# Altium project Tone_Stack_V2.PrjPcb
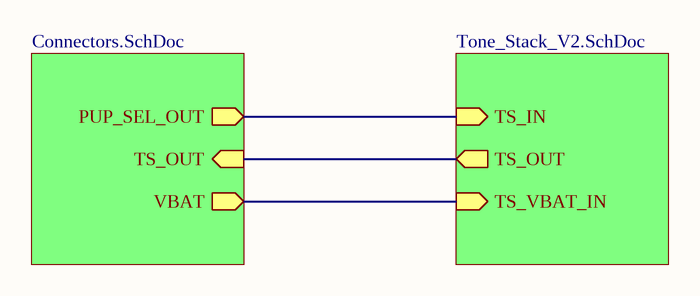
[diagram p0: Top.SchDoc]
3 sheets, 28 parts. Net scope: hierarchical (ports join the sheet entries above them; power ports are global).
Board file: Tone_Stack_V2.PcbDoc
Sheets:
  Top.SchDoc
    Designator = Connectors.SchDoc
    Designator = Tone_Stack_V2.SchDoc

## Sheet Top.SchDoc
size A4

### Sub-sheets
Designator = Connectors.SchDoc: PUP_SEL_OUT (out), TS_OUT (in), VBAT (out)
Designator = Tone_Stack_V2.SchDoc: TS_IN (in), TS_OUT (out), TS_VBAT_IN (in)

### Nets
PUP_SEL_OUT: sheet Designator/PUP_SEL_OUT, sheet Designator/TS_IN
TS_OUT: sheet Designator/TS_OUT, sheet Designator/TS_OUT
VBAT: sheet Designator/VBAT, sheet Designator/TS_VBAT_IN

## Sheet Connectors.SchDoc
size A4
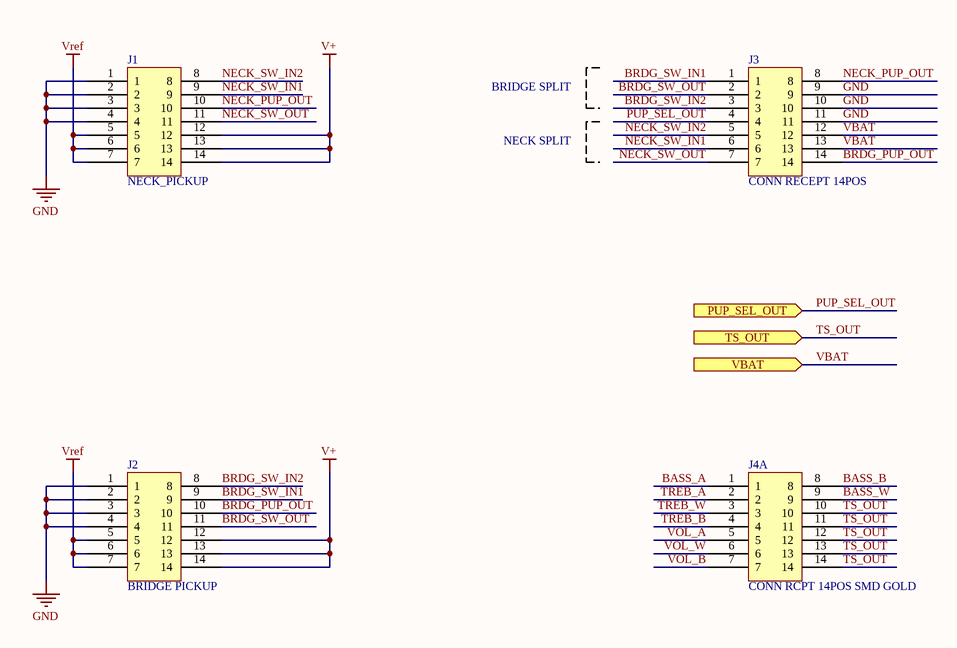
[diagram p1: Connectors.SchDoc]

### Parts
J1  CONN HEADER 14POS  [DF12(3.0)-14DP]  (value not drawn)
J2  CONN HEADER 14POS  [DF12(3.0)-14DP]  (value not drawn)
J3  CONN RECEPT 14POS  [DF12(3.0)-14DS]
J4  CONN RCPT 14POS SMD GOLD  [DF12(3.0)-14DS]  (part A of 4)

### Ports
PUP_SEL_OUT (in), TS_OUT (in), VBAT (in)

### Nets
GND: J1.1 J1.2 J1.3 J1.4 J2.1 J2.2 J2.3 J2.4 J3.9 J3.10 J3.11
V+: J1.12 J1.13 J1.14 J2.12 J2.13 J2.14
Vref: J1.5 J1.6 J1.7 J2.5 J2.6 J2.7
BASS_A: J4.1
BASS_B: J4.8
BASS_W: J4.9
BRDG_PUP_OUT: J2.10 J3.14
BRDG_SW_IN1: J2.9 J3.1
BRDG_SW_IN2: J2.8 J3.3
BRDG_SW_OUT: J2.11 J3.2
NECK_PUP_OUT: J1.10 J3.8
NECK_SW_IN1: J1.9 J3.6
NECK_SW_IN2: J1.8 J3.5
NECK_SW_OUT: J1.11 J3.7
PUP_SEL_OUT: J3.4 ; port PUP_SEL_OUT
TREB_A: J4.2
TREB_B: J4.4
TREB_W: J4.3
TS_OUT: J4.10 J4.11 J4.12 J4.13 J4.14 ; port TS_OUT
VBAT: J3.12 J3.13 ; port VBAT
VOL_A: J4.5
VOL_B: J4.7
VOL_W: J4.6

### Notes on the sheet
- BRIDGE SPLIT
- NECK SPLIT
- (near J1) NECK_PICKUP
- (near J2) BRIDGE PICKUP

### Library data of the parts
J1 J2 = DF12(3.0)-14DP-0.5V(86): 14 Position Connector Header, Outer Shroud Contacts Surface Mount Gold; Manufacturer: Hirose; Digikey Part Number: H11701CT-ND
J3 = DF12(3.0)-14DS-0.5V(86): 14 Position Connector Receptacle, Center Strip Contacts Surface Mount Gold; Manufacturer: Hirose; Digikey Part Number: H11702CT-ND
J4 = DF12(3.0)-14DS-0.5V(86)-COMPOSITE: 14 Position Connector Header, Outer Shroud Contacts Surface Mount Gold; Manufacturer: Hirose; Digikey Part Number: H11702CT-ND

## Sheet Tone_Stack_V2.SchDoc
size A4
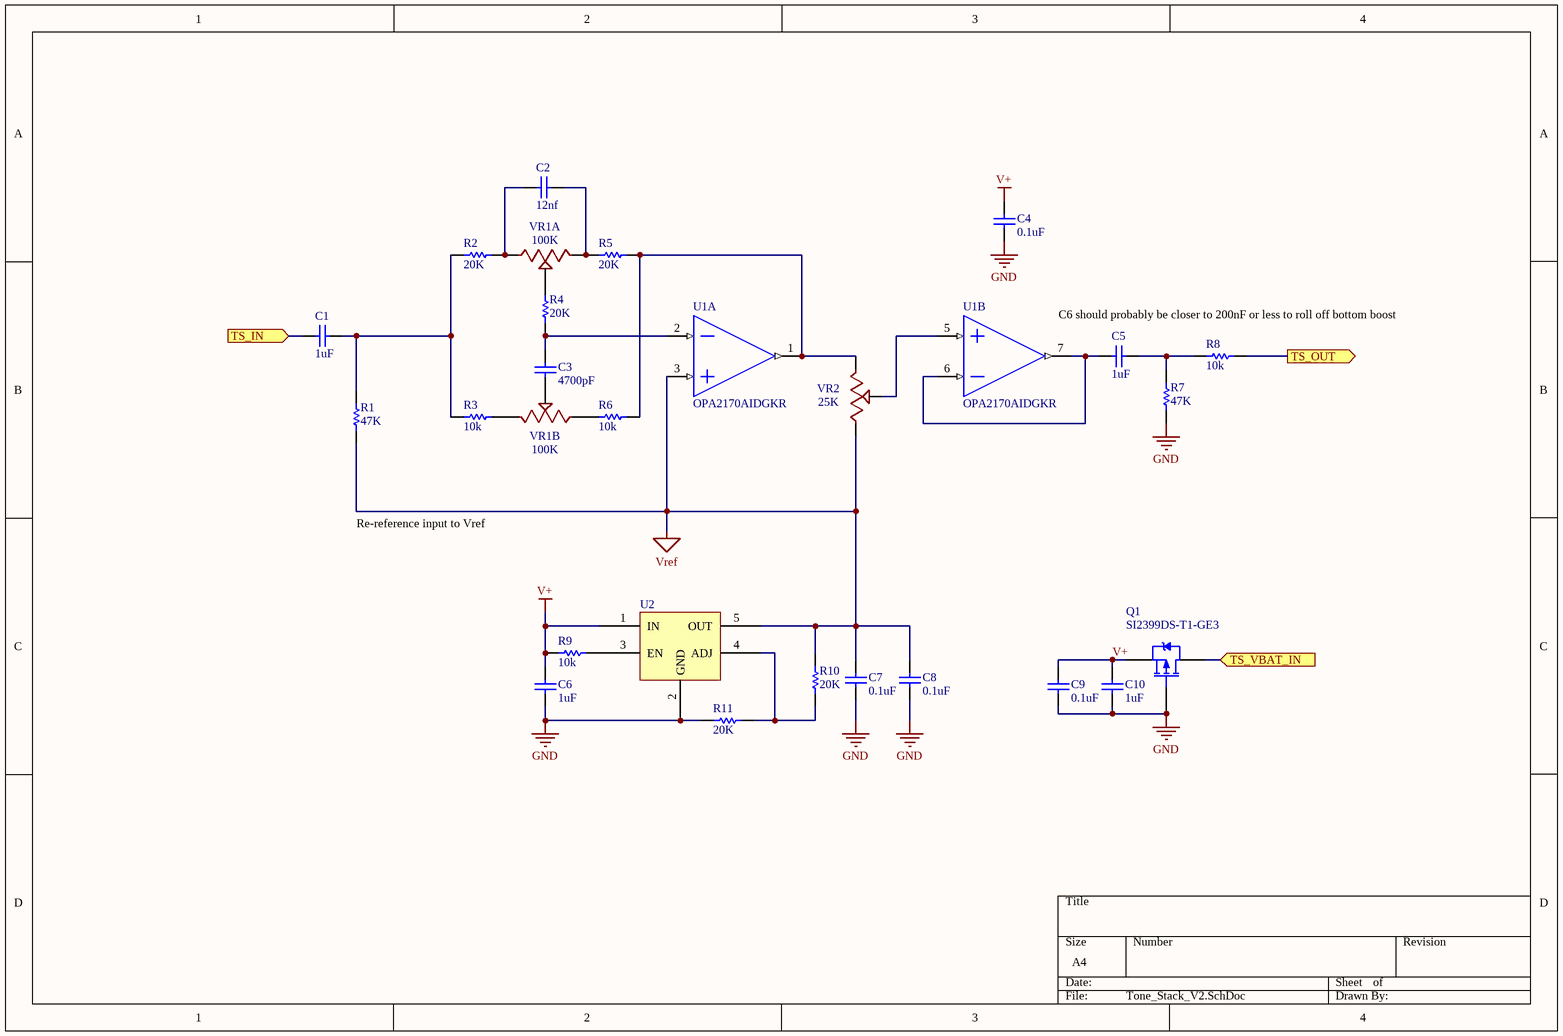
[diagram p2: Tone_Stack_V2.SchDoc]

### Parts
C1  1uF  [CAPC1608X09N]
C2  12nf  [CAPC1608X09N]
C3  4700pF  [CAPC1608X09N]
C4  0.1uF  [CAPC1608X09N]
C5  1uF  [CAPC1608X09N]
C6  1uF  [CAPC1608X09N]
C7  0.1uF  [CAPC1608X09N]
C8  0.1uF  [CAPC1608X09N]
C9  0.1uF  [CAPC1608X09N]
C10  1uF  [CAPC1608X09N]
J4  CONN RCPT 14POS SMD GOLD  [DF12(3.0)-14DS]  (value not drawn)  (parts B,C,D of 4)
Q1  SI2399DS-T1-GE3  [SOT95P237X112-3N]
R1  47K  [RESC1608X06N]
R2  20K  [RESC1608X06N]
R3  10k  [RESC1608X06N]
R4  20K  [RESC1608X06N]
R5  20K  [RESC1608X06N]
R6  10k  [RESC1608X06N]
R7  47K  [RESC1608X06N]
R8  10k  [RESC1608X06N]
R9  10k  [RESC1608X06N]
R10  20K  [RESC1608X06N]
R11  20K  [RESC1608X06N]
U1  OPA2170AIDGKR  [TSOP65P490X110-8N]  (parts A,B of 2)
U2  IC REG LIN POS ADJ 200MA SOT23-5  [SOT95P280X145-5N]  (value not drawn)

### Ports
TS_IN (in), TS_OUT (out), TS_VBAT_IN (in)

### Nets
GND: C4.1 C6.1 C7.1 C8.1 C9.1 C10.1 Q1.1(G) R7.1 R11.2 U1.4(V-) U2.2(GND)
V+: C4.2 C6.2 C9.2 C10.2 Q1.2(S) R9.1 U1.8(V+) U2.1(IN)
Vref: C7.2 C8.2 J4.7(B3) R1.1 R10.2 U1.3(+IN_A) U2.5(OUT)
PUP_SEL_OUT: C1.1 ; port TS_IN
TS_OUT: R8.2 ; port TS_OUT
VBAT: Q1.3(D) ; port TS_VBAT_IN
NetC1_2: C1.2 R1.2 R2.1 R3.1
NetC2_1: C2.1 J4.1(B1) R2.2
NetC2_2: C2.2 J4.8(A1) R5.1
NetC3_1: C3.1 J4.3(W2)
NetC3_2: C3.2 R4.1 U1.2(-IN_A)
NetC5_1: C5.1 U1.6(-IN_B) U1.7(OUT_B)
NetC5_2: C5.2 R7.2 R8.1
NetJ4_2: J4.2(A2) R3.2
NetJ4_4: J4.4(B2) R6.1
NetJ4_5: J4.5(A3) R5.2 R6.2 U1.1(Out_A)
NetJ4_6: J4.6(W3) U1.5(+IN_B)
NetJ4_9: J4.9(W1) R4.2
NetR9_2: R9.2 U2.3(EN)
NetR10_1: R10.1 R11.1 U2.4(ADJ)

### Notes on the sheet
- VR1A
- (near J4) 100K
- (near U1) C6 should probably be closer to 200nF or less to roll off bottom boost
- (near J4) VR1B
- (near J4) VR2
- (near J4) 25K
- Re-reference input to Vref

### Library data of the parts
C1 C5 C6 C10 = CAP CER 1UF 25V X7R 0603: 1µF ±10% 25V Ceramic Capacitor X7R 0603 (1608 Metric); Value: 1uF; Digikey Part Number: 490-10673-1-ND; Voltage: 25V; Rating: X7R; Tolerance: 10%; Package: 0603
C2 = CAP CER 0.012UF 25V C0G/NP0 0603: 0.012µF ±5% 25V Ceramic Capacitor C0G, NP0 0603 (1608 Metric); Manufacturer: Kemet; Digikey Part Number: 399-20390-1-ND; Value: 12nf; Rating: C0G/NP0; Tolerance: 5%; Voltage: 25V
C3 = CAP CER 4700PF 50V C0G/NP0 0603: 4700pF ±5% 50V Ceramic Capacitor C0G, NP0 0603 (1608 Metric); Manufacturer: Murata; Value: 4700pF; Digikey Part Number: 490-9669-1-ND; Voltage: 50V; Tolerance: 5%; Rating: C0G
C4 C7-C9 = CAP CER 0.1UF 50V X7R 0603: 0.1µF ±10% 50V Ceramic Capacitor X7R 0603 (1608 Metric); Value: 0.1uF; Digikey Part Number: 1276-CL10B104KB8NNNLCT-ND; Package: 0603; Voltage: 50V; Rating: X7R; Tolerance: 10%
J4 = DF12(3.0)-14DS-0.5V(86)-COMPOSITE: as J4 on sheet Connectors; Digikey Part Number: H11702CT-ND
Q1 = MOSFET_P_CH_20V_6A_SOT23-3: Reverse Voltage MOSFET; Manufacturer: Vishay Siliconix; VDS: 20V; Rds On (Max): 34 mOhm @ 5.1A, 10V; Digikey Part Number: SI2399DS-T1-GE3CT-ND; Value: SI2399DS-T1-GE3
R1 R7 = RES SMD 47K OHM 1% 1/10W 0603: RES 47K 0603; Tolerance: 1%; Type: RES; Footprint: 0603; Value: 47K; Digikey Part Number: 311-47.0KHRCT-ND
R2 R4 R5 R10 R11 = RES SMD 20K OHM 1% 1/10W 0603: Footprint: 0603; Tolerance: 1%; Value: 20K; Digikey Part Number: 311-20.0KHRCT-ND; Type: RES
R3 R6 R8 R9 = RES SMD 10K OHM 1% 1/10W 0603: Manufacturer: Yageo; Manufacturer Part Number: RC0603FR-0710KL; Power: 0.1W; Type: RES; Footprint: 0603; Tolerance: 1%; Temperature: 155dC; Digikey Part Number: 311-10.0KHRCT-ND; Value: 10k
U1 = OPA2170AIDGKR: General Purpose Amplifier 2 Circuit Rail-to-Rail 8-VSSOP; Manufacturer: Texas Instruments; Amplifier: Low Power; Digikey Part Number: 296-36694-1-ND
U2 = LDK320AM-R: Linear Voltage Regulator IC 1 Output 200mA SOT-23-5; Manufacturer: STMicroelectronics; Voltage - Input (Max): 18V; Voltage Dropout (Max): 0.35V @ 200mA; Current - Quiescent (Iq): 90µA; Digikey Part Number: 497-16672-1-ND; Current - Output: 200mA

## Nets that join several sheets
GND: Connectors (11 pins), Tone_Stack_V2 (11 pins)
V+: Connectors (6 pins), Tone_Stack_V2 (8 pins)
Vref: Connectors (6 pins), Tone_Stack_V2 (7 pins)
PUP_SEL_OUT: Connectors (J3.4), Tone_Stack_V2 (C1.1)
TS_OUT: Connectors (5 pins), Tone_Stack_V2 (R8.2)
VBAT: Connectors (J3.12 J3.13), Tone_Stack_V2 (Q1.3)